# Altium schematic sheet AHT20_Sensor.SchDoc
size A4; SheetNumber: 5; SheetTotal: 7
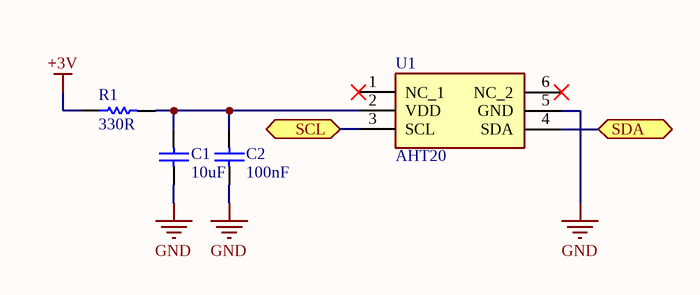
[diagram p0: AHT20_Sensor.SchDoc]

## Parts
C1  value 10uF  [Wurth 0603 capacitor]  (hidden comment: Generic Capacitor 10uF 0603)
C2  value 100nF  [Wurth 0603 capacitor]  (hidden comment: Generic Capacitor 100nF 0603)
R1  value 330R  [Wurth 0603 Resistor]  (hidden comment: Generic Resistor 330R 0603)
U1  AHT20  [AHT20]

## Ports
SCL (bidir), SDA (bidir)

## Nets
+3V: R1.1
GND: C1.1 C2.1 U1.5(GND)
SCL: U1.3(SCL) ; port SCL
SDA: U1.4(SDA) ; port SDA
NetC1_2: C1.2 C2.2 R1.2 U1.2(VDD)

Not connected (* = marked no-connect by the designer): U1 1(NC_1)* 6(NC_2)*

## Library data of the parts
U1 = AHT20: Undefined or Miscellaneous; Manufacturer_Name: Aosong; Datasheet Link: http://www.aosong.com/userfiles/files/media/Data%20Sheet%20AHT20.pdf; Height: 1.1mm; Manufacturer_Part_Number: AHT20